# EAGLE schematic mixer (EAGLE 6.5.0)

## Sheet 1 of 2
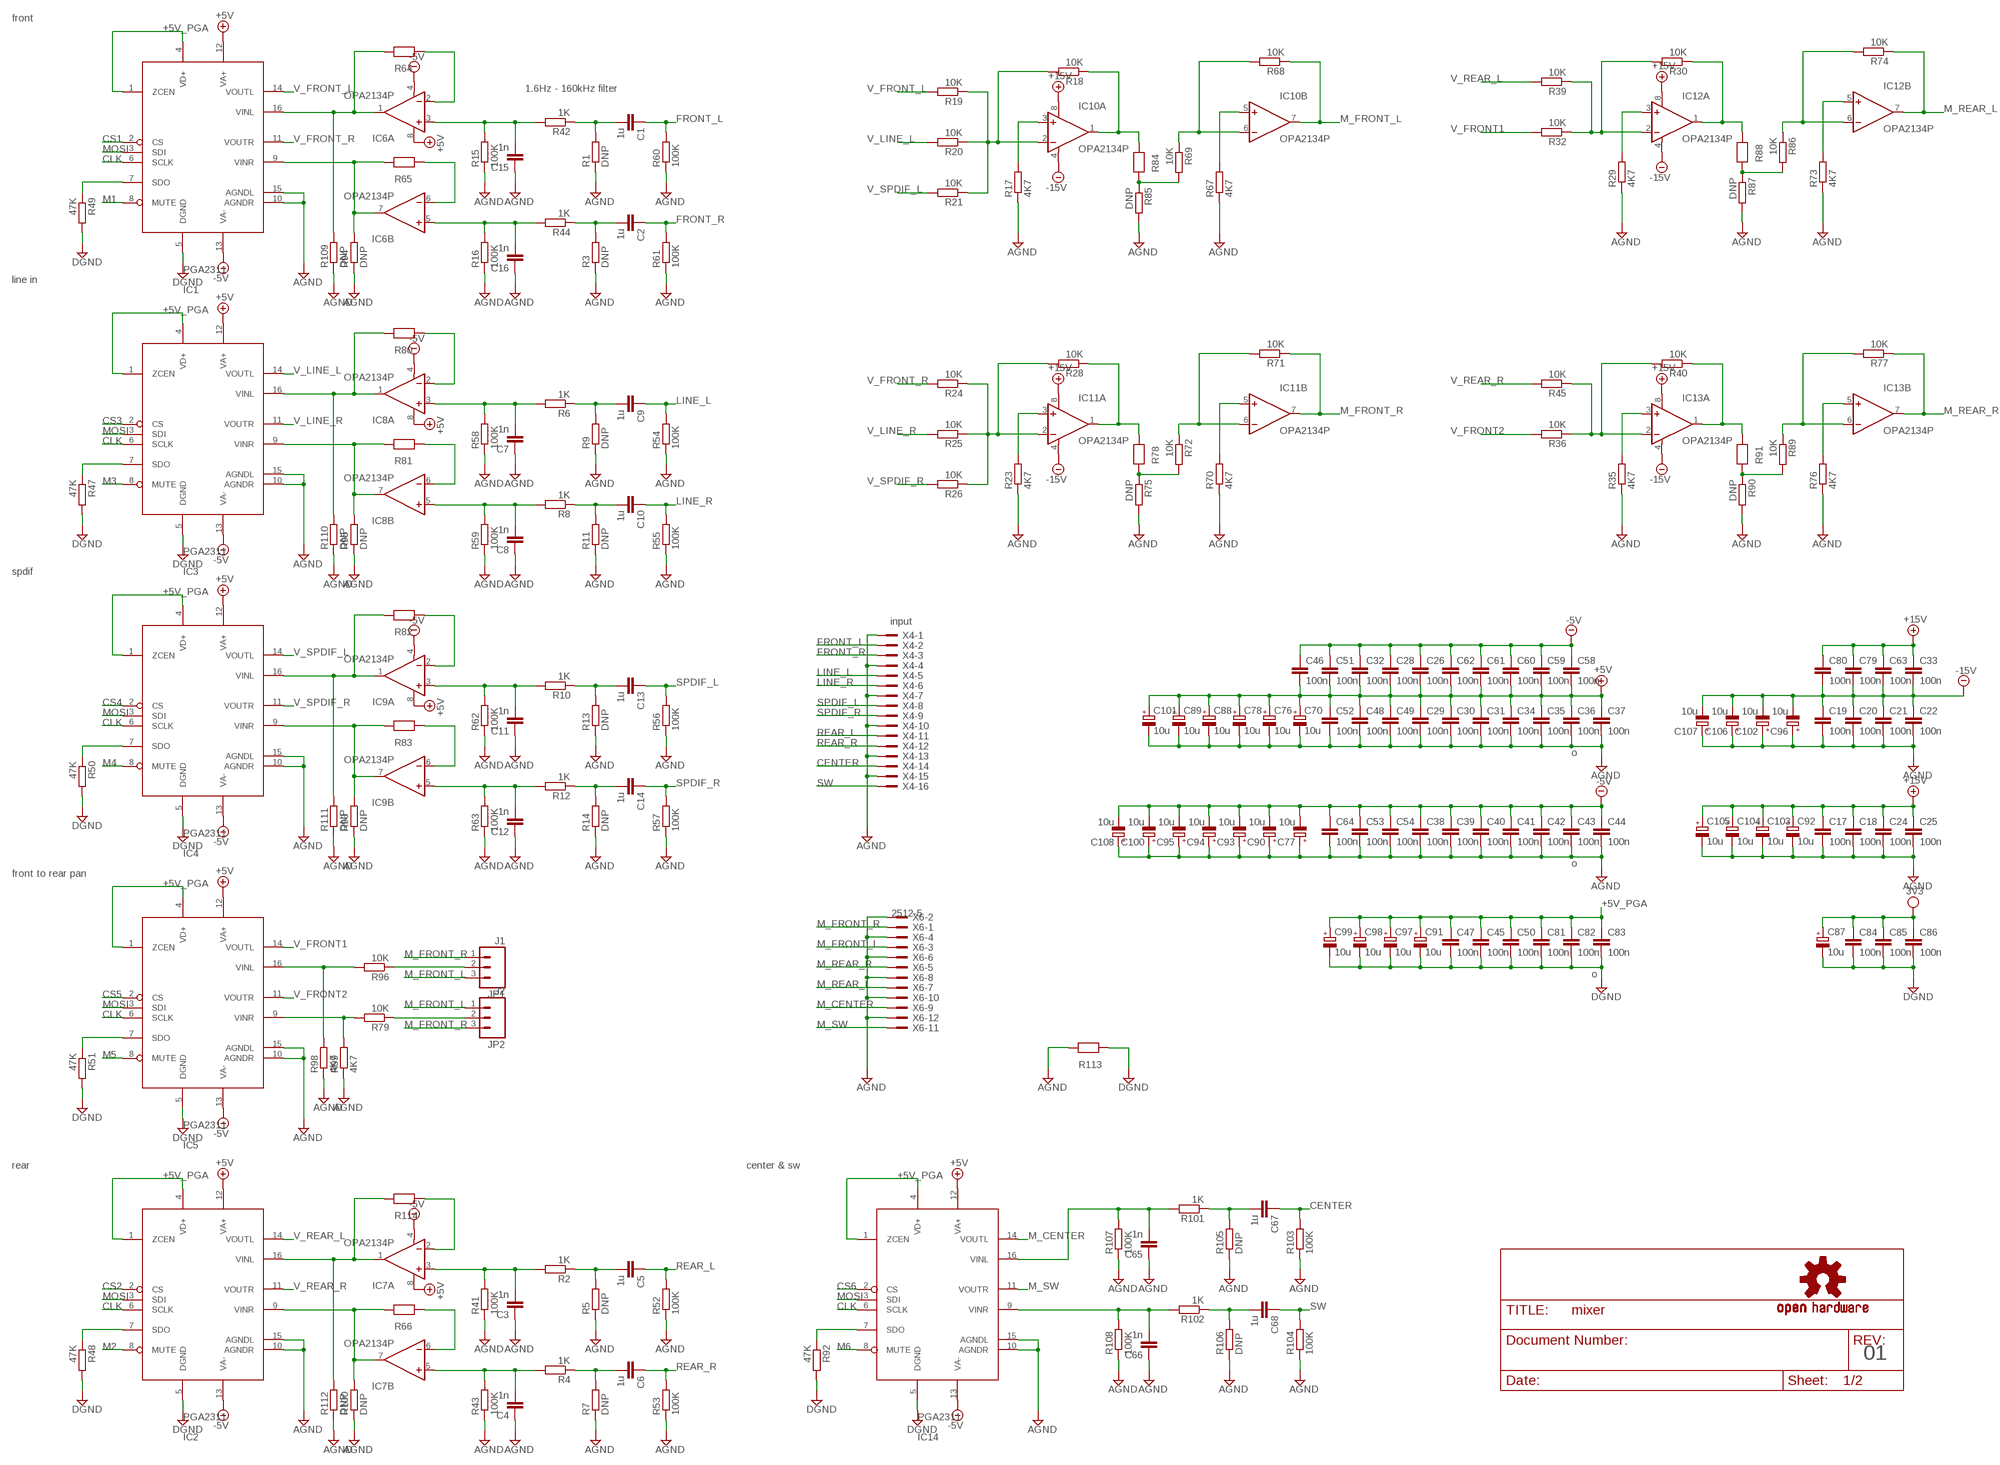
[diagram p0: schematic, sheet 1]

### Parts
C1  1u  C-EUC0805  [C0805]
C2  1u  C-EUC0805  [C0805]
C3  1n  C-EUC0805  [C0805]
C4  1n  C-EUC0805  [C0805]
C5  1u  C-EUC0805  [C0805]
C6  1u  C-EUC0805  [C0805]
C7  1n  C-EUC0805  [C0805]
C8  1n  C-EUC0805  [C0805]
C9  1u  C-EUC0805  [C0805]
C10  1u  C-EUC0805  [C0805]
C11  1n  C-EUC0805  [C0805]
C12  1n  C-EUC0805  [C0805]
C13  1u  C-EUC0805  [C0805]
C14  1u  C-EUC0805  [C0805]
C15  1n  C-EUC0805  [C0805]
C16  1n  C-EUC0805  [C0805]
C17  100n  C-EUC0805  [C0805]
C18  100n  C-EUC0805  [C0805]
C19  100n  C-EUC0805  [C0805]
C20  100n  C-EUC0805  [C0805]
C21  100n  C-EUC0805  [C0805]
C22  100n  C-EUC0805  [C0805]
C24  100n  C-EUC0805  [C0805]
C25  100n  C-EUC0805  [C0805]
C26  100n  C-EUC0805  [C0805]
C28  100n  C-EUC0805  [C0805]
C29  100n  C-EUC0805  [C0805]
C30  100n  C-EUC0805  [C0805]
C31  100n  C-EUC0805  [C0805]
C32  100n  C-EUC0805  [C0805]
C33  100n  C-EUC0805  [C0805]
C34  100n  C-EUC0805  [C0805]
C35  100n  C-EUC0805  [C0805]
C36  100n  C-EUC0805  [C0805]
C37  100n  C-EUC0805  [C0805]
C38  100n  C-EUC0805  [C0805]
C39  100n  C-EUC0805  [C0805]
C40  100n  C-EUC0805  [C0805]
C41  100n  C-EUC0805  [C0805]
C42  100n  C-EUC0805  [C0805]
C43  100n  C-EUC0805  [C0805]
C44  100n  C-EUC0805  [C0805]
C45  100n  C-EUC0805  [C0805]
C46  100n  C-EUC0805  [C0805]
C47  100n  C-EUC0805  [C0805]
C48  100n  C-EUC0805  [C0805]
C49  100n  C-EUC0805  [C0805]
C50  100n  C-EUC0805  [C0805]
C51  100n  C-EUC0805  [C0805]
C52  100n  C-EUC0805  [C0805]
C53  100n  C-EUC0805  [C0805]
C54  100n  C-EUC0805  [C0805]
C58  100n  C-EUC0805  [C0805]
C59  100n  C-EUC0805  [C0805]
C60  100n  C-EUC0805  [C0805]
C61  100n  C-EUC0805  [C0805]
C62  100n  C-EUC0805  [C0805]
C63  100n  C-EUC0805  [C0805]
C64  100n  C-EUC0805  [C0805]
C65  1n  C-EUC0805  [C0805]
C66  1n  C-EUC0805  [C0805]
C67  1u  C-EUC0805  [C0805]
C68  1u  C-EUC0805  [C0805]
C70  10u  CPOL-EU153CLV-0405  [153CLV-0405]
C76  10u  CPOL-EU153CLV-0405  [153CLV-0405]
C77  10u  CPOL-EU153CLV-0405  [153CLV-0405]
C78  10u  CPOL-EU153CLV-0405  [153CLV-0405]
C79  100n  C-EUC0805  [C0805]
C80  100n  C-EUC0805  [C0805]
C81  100n  C-EUC0805  [C0805]
C82  100n  C-EUC0805  [C0805]
C83  100n  C-EUC0805  [C0805]
C84  100n  C-EUC0805  [C0805]
C85  100n  C-EUC0805  [C0805]
C86  100n  C-EUC0805  [C0805]
C87  10u  CPOL-EU153CLV-0405  [153CLV-0405]
C88  10u  CPOL-EU153CLV-0405  [153CLV-0405]
C89  10u  CPOL-EU153CLV-0405  [153CLV-0405]
C90  10u  CPOL-EU153CLV-0405  [153CLV-0405]
C91  10u  CPOL-EU153CLV-0405  [153CLV-0405]
C92  10u  CPOL-EU153CLV-0405  [153CLV-0405]
C93  10u  CPOL-EU153CLV-0405  [153CLV-0405]
C94  10u  CPOL-EU153CLV-0405  [153CLV-0405]
C95  10u  CPOL-EU153CLV-0405  [153CLV-0405]
C96  10u  CPOL-EU153CLV-0405  [153CLV-0405]
C97  10u  CPOL-EU153CLV-0405  [153CLV-0405]
C98  10u  CPOL-EU153CLV-0405  [153CLV-0405]
C99  10u  CPOL-EU153CLV-0405  [153CLV-0405]
C100  10u  CPOL-EU153CLV-0405  [153CLV-0405]
C101  10u  CPOL-EU153CLV-0405  [153CLV-0405]
C102  10u  CPOL-EU153CLV-0405  [153CLV-0405]
C103  10u  CPOL-EU153CLV-0405  [153CLV-0405]
C104  10u  CPOL-EU153CLV-0405  [153CLV-0405]
C105  10u  CPOL-EU153CLV-0405  [153CLV-0405]
C106  10u  CPOL-EU153CLV-0405  [153CLV-0405]
C107  10u  CPOL-EU153CLV-0405  [153CLV-0405]
C108  10u  CPOL-EU153CLV-0405  [153CLV-0405]
IC1  PGA2311  [SO-16]
IC2  PGA2311  [SO-16]
IC3  PGA2311  [SO-16]
IC4  PGA2311  [SO-16]
IC5  PGA2311  [SO-16]
IC6  OPA2134P  [DIL08]
IC7  OPA2134P  [DIL08]
IC8  OPA2134P  [DIL08]
IC9  OPA2134P  [DIL08]
IC10  OPA2134P  [DIL08]
IC11  OPA2134P  [DIL08]
IC12  OPA2134P  [DIL08]
IC13  OPA2134P  [DIL08]
IC14  PGA2311  [SO-16]
JP1  J1  M03PTH  [1X03]
JP2  J2  M03PTH  [1X03]
R1  DNP  R-EU_R0805W  [R0805W]
R2  1K  R-EU_R0805W  [R0805W]
R3  DNP  R-EU_R0805W  [R0805W]
R4  1K  R-EU_R0805W  [R0805W]
R5  DNP  R-EU_R0805W  [R0805W]
R6  1K  R-EU_R0805W  [R0805W]
R7  DNP  R-EU_R0805W  [R0805W]
R8  1K  R-EU_R0805W  [R0805W]
R9  DNP  R-EU_R0805W  [R0805W]
R10  1K  R-EU_R0805W  [R0805W]
R11  DNP  R-EU_R0805W  [R0805W]
R12  1K  R-EU_R0805W  [R0805W]
R13  DNP  R-EU_R0805W  [R0805W]
R14  DNP  R-EU_R0805W  [R0805W]
R15  100K  R-EU_R0805W  [R0805W]
R16  100K  R-EU_R0805W  [R0805W]
R17  4K7  R-EU_R0805W  [R0805W]
R18  10K  R-EU_R0805W  [R0805W]
R19  10K  R-EU_R0805W  [R0805W]
R20  10K  R-EU_R0805W  [R0805W]
R21  10K  R-EU_R0805W  [R0805W]
R23  4K7  R-EU_R0805W  [R0805W]
R24  10K  R-EU_R0805W  [R0805W]
R25  10K  R-EU_R0805W  [R0805W]
R26  10K  R-EU_R0805W  [R0805W]
R28  10K  R-EU_R0805W  [R0805W]
R29  4K7  R-EU_R0805W  [R0805W]
R30  10K  R-EU_R0805W  [R0805W]
R32  10K  R-EU_R0805W  [R0805W]
R35  4K7  R-EU_R0805W  [R0805W]
R36  10K  R-EU_R0805W  [R0805W]
R39  10K  R-EU_R0805W  [R0805W]
R40  10K  R-EU_R0805W  [R0805W]
R41  100K  R-EU_R0805W  [R0805W]
R42  1K  R-EU_R0805W  [R0805W]
R43  100K  R-EU_R0805W  [R0805W]
R44  1K  R-EU_R0805W  [R0805W]
R45  10K  R-EU_R0805W  [R0805W]
R47  47K  R-EU_R0805W  [R0805W]
R48  47K  R-EU_R0805W  [R0805W]
R49  47K  R-EU_R0805W  [R0805W]
R50  47K  R-EU_R0805W  [R0805W]
R51  47K  R-EU_R0805W  [R0805W]
R52  100K  R-EU_R0805W  [R0805W]
R53  100K  R-EU_R0805W  [R0805W]
R54  100K  R-EU_R0805W  [R0805W]
R55  100K  R-EU_R0805W  [R0805W]
R56  100K  R-EU_R0805W  [R0805W]
R57  100K  R-EU_R0805W  [R0805W]
R58  100K  R-EU_R0805W  [R0805W]
R59  100K  R-EU_R0805W  [R0805W]
R60  100K  R-EU_R0805W  [R0805W]
R61  100K  R-EU_R0805W  [R0805W]
R62  100K  R-EU_R0805W  [R0805W]
R63  100K  R-EU_R0805W  [R0805W]
R64  0R_0805  [R0805W]
R65  0R_0805  [R0805W]
R66  0R_0805  [R0805W]
R67  4K7  R-EU_R0805W  [R0805W]
R68  10K  R-EU_R0805W  [R0805W]
R69  10K  R-EU_R0805W  [R0805W]
R70  4K7  R-EU_R0805W  [R0805W]
R71  10K  R-EU_R0805W  [R0805W]
R72  10K  R-EU_R0805W  [R0805W]
R73  4K7  R-EU_R0805W  [R0805W]
R74  10K  R-EU_R0805W  [R0805W]
R75  DNP  R-EU_R0805W  [R0805W]
R76  4K7  R-EU_R0805W  [R0805W]
R77  10K  R-EU_R0805W  [R0805W]
R78  0R_0805  [R0805W]
R79  10K  R-EU_R0805W  [R0805W]
R80  0R_0805  [R0805W]
R81  0R_0805  [R0805W]
R82  0R_0805  [R0805W]
R83  0R_0805  [R0805W]
R84  0R_0805  [R0805W]
R85  DNP  R-EU_R0805W  [R0805W]
R86  10K  R-EU_R0805W  [R0805W]
R87  DNP  R-EU_R0805W  [R0805W]
R88  0R_0805  [R0805W]
R89  10K  R-EU_R0805W  [R0805W]
R90  DNP  R-EU_R0805W  [R0805W]
R91  0R_0805  [R0805W]
R92  47K  R-EU_R0805W  [R0805W]
R93  DNP  R-EU_R0805W  [R0805W]
R94  DNP  R-EU_R0805W  [R0805W]
R95  DNP  R-EU_R0805W  [R0805W]
R96  10K  R-EU_R0805W  [R0805W]
R98  4K7  R-EU_R0805W  [R0805W]
R99  4K7  R-EU_R0805W  [R0805W]
R100  DNP  R-EU_R0805W  [R0805W]
R101  1K  R-EU_R0805W  [R0805W]
R102  1K  R-EU_R0805W  [R0805W]
R103  100K  R-EU_R0805W  [R0805W]
R104  100K  R-EU_R0805W  [R0805W]
R105  DNP  R-EU_R0805W  [R0805W]
R106  DNP  R-EU_R0805W  [R0805W]
R107  100K  R-EU_R0805W  [R0805W]
R108  100K  R-EU_R0805W  [R0805W]
R109  DNP  R-EU_R0805W  [R0805W]
R110  DNP  R-EU_R0805W  [R0805W]
R111  DNP  R-EU_R0805W  [R0805W]
R112  DNP  R-EU_R0805W  [R0805W]
R113  0R_0805  [R0805W]
R114  0R_0805  [R0805W]
U$7  OSHW-LOGOM  [OSHW-LOGO-M]
X4  input  2516-5  [PAK100/2500-5-16]
X6  2512-5  [PAK100/2500-5-12]

### Nets
3V3: C84.1 C85.1 C86.1 C87.+ ; also sheet 2
+5V: C26.2 C28.2 C29.1 C30.1 C31.1 C32.2 C34.1 C35.1 C36.1 C37.1 C46.2 C48.1 C49.1 C51.2 C52.1 C58.2 C59.2 C60.2 C61.2 C62.2 C70.+ C76.+ C78.+ C88.+ C89.+ C101.+ IC1.12(VA+) IC2.12(VA+) IC3.12(VA+) IC4.12(VA+) IC5.12(VA+) IC6.8(A:V+) IC7.8(A:V+) IC8.8(A:V+) IC9.8(A:V+) IC14.12(VA+) ; also sheet 2
+5V_PGA: C45.1 C47.1 C50.1 C81.1 C82.1 C83.1 C91.+ C97.+ C98.+ C99.+ IC1.1(ZCEN) IC1.4(VD+) IC2.1(ZCEN) IC2.4(VD+) IC3.1(ZCEN) IC3.4(VD+) IC4.1(ZCEN) IC4.4(VD+) IC5.1(ZCEN) IC5.4(VD+) IC14.1(ZCEN) IC14.4(VD+) ; also sheet 2
+15V: C17.1 C18.1 C24.1 C25.1 C33.1 C63.1 C79.1 C80.1 C92.+ C103.+ C104.+ C105.+ IC10.8(A:V+) IC11.8(A:V+) IC12.8(A:V+) IC13.8(A:V+) ; also sheet 2
-5V: C26.1 C28.1 C32.1 C38.1 C39.1 C40.1 C41.1 C42.1 C43.1 C44.1 C46.1 C51.1 C53.1 C54.1 C58.1 C59.1 C60.1 C61.1 C62.1 C64.1 C77.- C90.- C93.- C94.- C95.- C100.- C108.- IC1.13(VA-) IC2.13(VA-) IC3.13(VA-) IC4.13(VA-) IC5.13(VA-) IC6.4(A:V-) IC7.4(A:V-) IC8.4(A:V-) IC9.4(A:V-) IC14.13(VA-) ; also sheet 2
-15V: C19.1 C20.1 C21.1 C22.1 C33.2 C63.2 C79.2 C80.2 C96.- C102.- C106.- C107.- IC10.4(A:V-) IC11.4(A:V-) IC12.4(A:V-) IC13.4(A:V-) ; also sheet 2
AGND: C3.1 C4.1 C7.1 C8.1 C11.1 C12.1 C15.1 C16.1 C17.2 C18.2 C19.2 C20.2 C21.2 C22.2 C24.2 C25.2 C29.2 C30.2 C31.2 C34.2 C35.2 C36.2 C37.2 C38.2 C39.2 C40.2 C41.2 C42.2 C43.2 C44.2 C48.2 C49.2 C52.2 C53.2 C54.2 C64.2 C65.1 C66.1 C70.- C76.- C77.+ C78.- C88.- C89.- C90.+ C92.- C93.+ C94.+ C95.+ C96.+ C100.+ C101.- C102.+ C103.- C104.- C105.- C106.+ C107.+ C108.+ IC1.10(AGNDR) IC1.15(AGNDL) IC2.10(AGNDR) IC2.15(AGNDL) IC3.10(AGNDR) IC3.15(AGNDL) IC4.10(AGNDR) IC4.15(AGNDL) IC5.10(AGNDR) IC5.15(AGNDL) IC14.10(AGNDR) IC14.15(AGNDL) R1.1 R3.1 R5.1 R7.1 R9.1 R11.1 R13.1 R14.1 R15.1 R16.1 R17.1 R23.1 R29.1 R35.1 R41.1 R43.1 R52.1 R53.1 R54.1 R55.1 R56.1 R57.1 R58.1 R59.1 R60.1 R61.1 R62.1 R63.1 R67.1 R70.1 R73.1 R75.2 R76.1 R85.2 R87.2 R90.2 R93.1 R94.1 R95.1 R98.1 R99.1 R100.1 R103.1 R104.1 R105.1 R106.1 R107.1 R108.1 R109.1 R110.1 R111.1 R112.1 R113.1 X4.1 X4.4 X4.7 X4.10 X4.13 X4.15 X6.2 X6.4 X6.6 X6.8 X6.10 X6.12 ; also sheet 2
CENTER: C67.1 R103.2 X4.14
CLK: IC1.6(SCLK) IC2.6(SCLK) IC3.6(SCLK) IC4.6(SCLK) IC5.6(SCLK) IC14.6(SCLK) ; also sheet 2
CS1: IC1.2(CS) ; also sheet 2
CS2: IC2.2(CS) ; also sheet 2
CS3: IC3.2(CS) ; also sheet 2
CS4: IC4.2(CS) ; also sheet 2
CS5: IC5.2(CS) ; also sheet 2
CS6: IC14.2(CS) ; also sheet 2
DGND: C45.2 C47.2 C50.2 C81.2 C82.2 C83.2 C84.2 C85.2 C86.2 C87.- C91.- C97.- C98.- C99.- IC1.5(DGND) IC2.5(DGND) IC3.5(DGND) IC4.5(DGND) IC5.5(DGND) IC14.5(DGND) R47.2 R48.2 R49.2 R50.2 R51.2 R92.2 R113.2 ; also sheet 2
FRONT_L: C1.1 R60.2 X4.2
FRONT_R: C2.1 R61.2 X4.3
LINE_L: C9.1 R54.2 X4.5
LINE_R: C10.1 R55.2 X4.6
M1: IC1.8(MUTE) ; also sheet 2
M2: IC2.8(MUTE) ; also sheet 2
M3: IC3.8(MUTE) ; also sheet 2
M4: IC4.8(MUTE) ; also sheet 2
M5: IC5.8(MUTE) ; also sheet 2
M6: IC14.8(MUTE) ; also sheet 2
M_CENTER: IC14.14(VOUTL) X6.9
M_FRONT_L: IC10.7(B:OUT) JP1.3 JP2.1 R68.1 X6.3
M_FRONT_R: IC11.7(B:OUT) JP1.1 JP2.3 R71.1 X6.1
M_REAR_L: IC12.7(B:OUT) R74.1 X6.7
M_REAR_R: IC13.7(B:OUT) R77.1 X6.5
M_SW: IC14.11(VOUTR) X6.11
MOSI: IC1.3(SDI) IC2.3(SDI) IC3.3(SDI) IC4.3(SDI) IC5.3(SDI) IC14.3(SDI) ; also sheet 2
N$1: C1.2 R1.2 R42.1
N$2: C2.2 R3.2 R44.1
N$3: IC14.7(SDO) R92.1
N$4: IC2.16(VINL) IC7.1(A:OUT) R112.2 R114.1
N$5: IC1.16(VINL) IC6.1(A:OUT) R64.1 R109.2
N$7: IC2.9(VINR) IC7.7(B:OUT) R66.1 R100.2
N$8: C4.2 IC7.5(B:+IN) R4.2 R43.2
N$9: C3.2 IC7.3(A:+IN) R2.2 R41.2
N$11: C5.2 R2.1 R5.2
N$12: C6.2 R4.1 R7.2
N$15: IC3.16(VINL) IC8.1(A:OUT) R80.1 R110.2
N$16: IC3.9(VINR) IC8.7(B:OUT) R81.1 R95.2
N$17: IC1.9(VINR) IC6.7(B:OUT) R65.1 R94.2
N$18: C8.2 IC8.5(B:+IN) R8.2 R59.2
N$19: IC4.16(VINL) IC9.1(A:OUT) R82.1 R111.2
N$20: C7.2 IC8.3(A:+IN) R6.2 R58.2
N$22: C9.2 R6.1 R9.2
N$23: C10.2 R8.1 R11.2
N$24: C65.2 IC14.16(VINL) R101.2 R107.2
N$26: IC4.9(VINR) IC9.7(B:OUT) R83.1 R93.2
N$27: C12.2 IC9.5(B:+IN) R12.2 R63.2
N$28: C11.2 IC9.3(A:+IN) R10.2 R62.2
N$29: C16.2 IC6.5(B:+IN) R16.2 R44.2
N$31: C13.2 R10.1 R13.2
N$32: C14.2 R12.1 R14.2
N$33: C15.2 IC6.3(A:+IN) R15.2 R42.2
N$34: C66.2 IC14.9(VINR) R102.2 R108.2
N$36: JP1.2 R96.1
N$37: IC6.2(A:-IN) R64.2
N$42: IC5.16(VINL) R96.2 R98.2
N$43: IC6.6(B:-IN) R65.2
N$44: IC1.7(SDO) R49.1
N$45: IC3.7(SDO) R47.1
N$46: IC10.3(A:+IN) R17.2
N$47: IC10.2(A:-IN) R18.2 R19.1 R20.1 R21.1
N$48: IC7.2(A:-IN) R114.2
N$49: IC10.1(A:OUT) R18.1 R84.2
N$50: IC7.6(B:-IN) R66.2
N$51: IC13.2(A:-IN) R36.1 R40.2 R45.1
N$52: IC11.3(A:+IN) R23.2
N$53: IC11.2(A:-IN) R24.1 R25.1 R26.1 R28.2
N$54: IC10.5(B:+IN) R67.2
N$55: IC10.6(B:-IN) R68.2 R69.1
N$56: IC8.2(A:-IN) R80.2
N$57: IC2.7(SDO) R48.1
N$58: IC12.3(A:+IN) R29.2
N$59: IC4.7(SDO) R50.1
N$61: IC11.5(B:+IN) R70.2
N$62: C67.2 R101.1 R105.2
N$63: C68.2 R102.1 R106.2
N$64: IC13.3(A:+IN) R35.2
N$65: IC5.7(SDO) R51.1
N$66: IC11.6(B:-IN) R71.2 R72.1
N$67: IC8.6(B:-IN) R81.2
N$68: IC12.5(B:+IN) R73.2
N$69: IC12.6(B:-IN) R74.2 R86.1
N$70: IC9.2(A:-IN) R82.2
N$71: IC13.5(B:+IN) R76.2
N$72: IC13.6(B:-IN) R77.2 R89.1
N$73: IC9.6(B:-IN) R83.2
N$74: IC12.2(A:-IN) R30.2 R32.1 R39.1
N$75: IC11.1(A:OUT) R28.1 R78.2
N$76: IC12.1(A:OUT) R30.1 R88.2
N$77: R69.2 R84.1 R85.1
N$78: IC13.1(A:OUT) R40.1 R91.2
N$79: IC5.9(VINR) R79.2 R99.2
N$80: JP2.2 R79.1
N$81: R72.2 R75.1 R78.1
N$84: R86.2 R87.1 R88.1
N$87: R89.2 R90.1 R91.1
REAR_L: C5.1 R52.2 X4.11
REAR_R: C6.1 R53.2 X4.12
SPDIF_L: C13.1 R56.2 X4.8
SPDIF_R: C14.1 R57.2 X4.9
SW: C68.1 R104.2 X4.16
V_FRONT1: IC5.14(VOUTL) R32.2
V_FRONT2: IC5.11(VOUTR) R36.2
V_FRONT_L: IC1.14(VOUTL) R19.2
V_FRONT_R: IC1.11(VOUTR) R24.2
V_LINE_L: IC3.14(VOUTL) R20.2
V_LINE_R: IC3.11(VOUTR) R25.2
V_REAR_L: IC2.14(VOUTL) R39.2
V_REAR_R: IC2.11(VOUTR) R45.2
V_SPDIF_L: IC4.14(VOUTL) R21.2
V_SPDIF_R: IC4.11(VOUTR) R26.2

### Notes on the sheet
- front
- 1.6Hz - 160kHz filter
- line in
- spdif
- o
- o
- front to rear pan
- o
- rear | center & sw
- 01

## Sheet 2 of 2
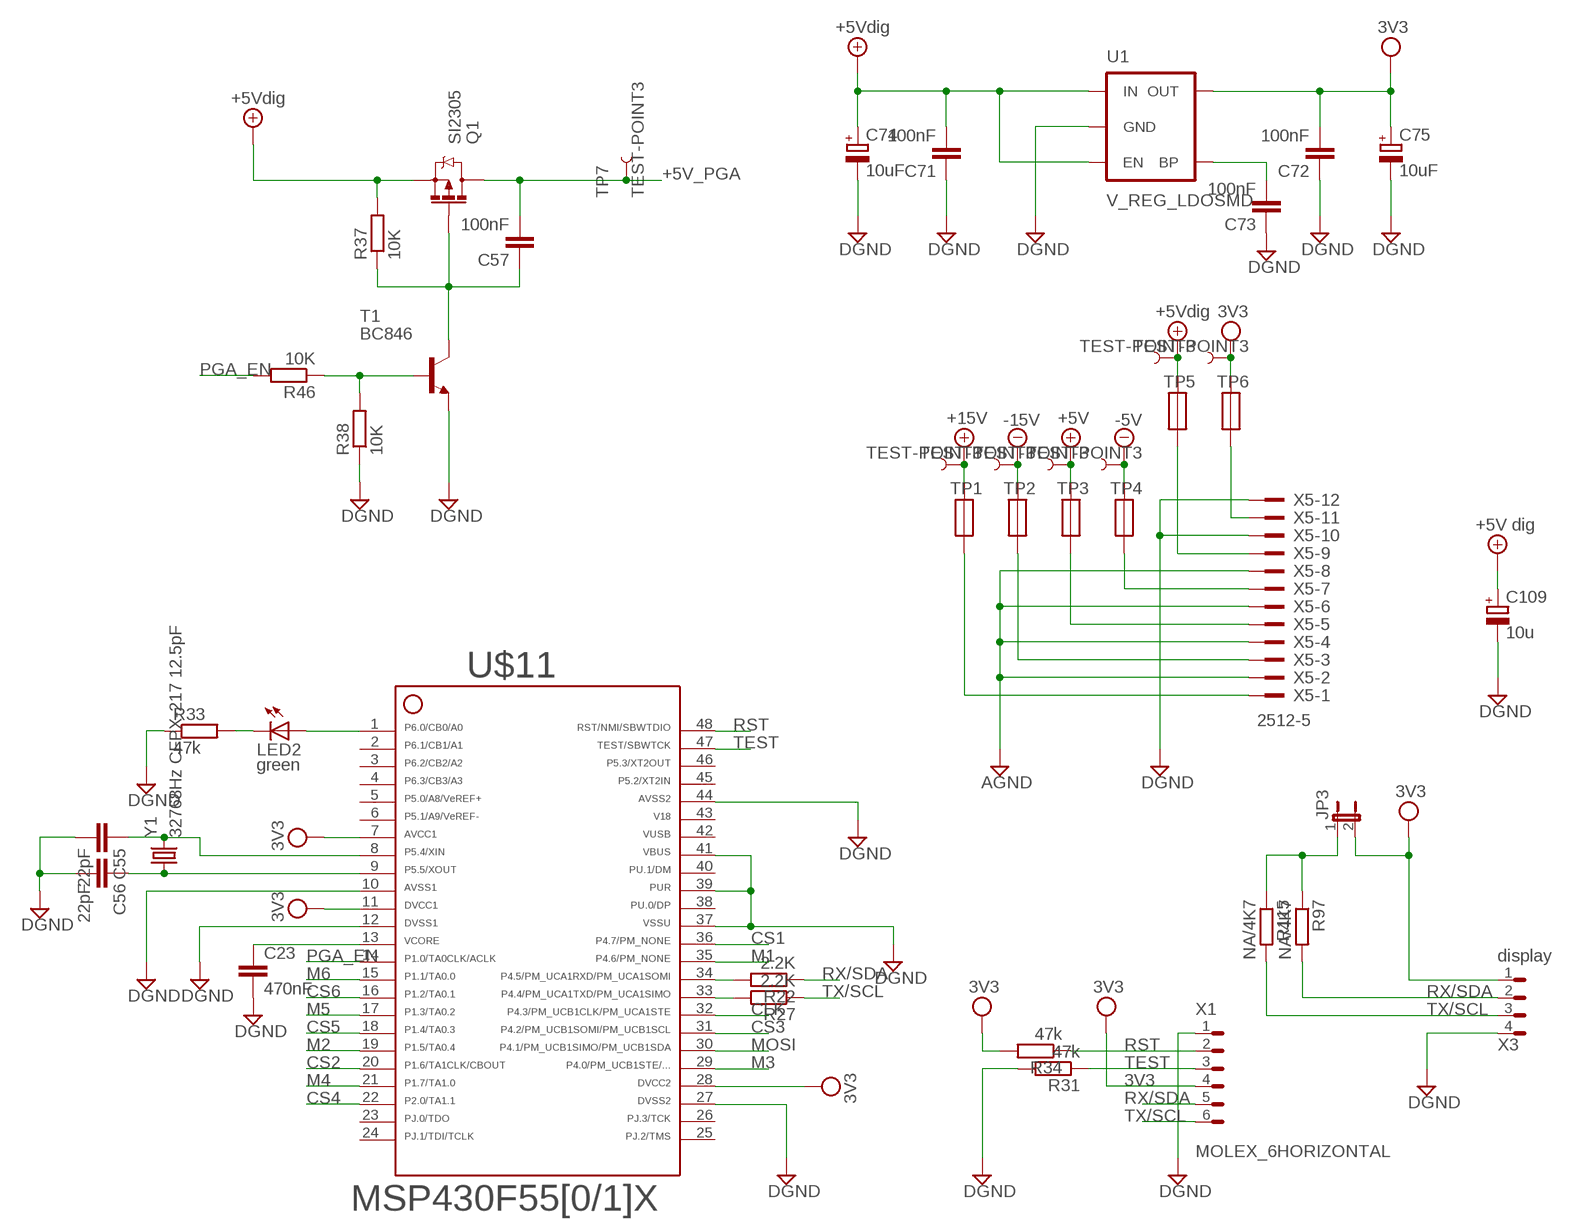
[diagram p1: schematic, sheet 2]

### Parts
C23  470nF  C-EUC0805  [C0805]
C55  22pF  C-EUC0805  [C0805]
C56  22pF  C-EUC0805  [C0805]
C57  100nF  C-EUC0805  [C0805]
C71  100nF  C-EUC0805  [C0805]
C72  100nF  C-EUC0805  [C0805]
C73  100nF  C-EUC0805  [C0805]
C74  10uF  CPOL-EU153CLV-0405  [153CLV-0405]
C75  10uF  CPOL-EU153CLV-0405  [153CLV-0405]
C109  10u  CPOL-EU153CLV-0405  [153CLV-0405]
JP3  JUMPER-2SMD-NO  [SJ_2S-NO]
LED2  green  LEDCHIPLED_0805  [CHIPLED_0805]
Q1  SI2305  MOSFET-PCHANNEL_SOT23-3_POWER  [SOT23-3_POWER]
R22  2.2K  R-EU_R0805W  [R0805W]
R27  2.2K  R-EU_R0805W  [R0805W]
R31  47k  R-EU_R0805W  [R0805W]
R33  47k  R-EU_R0805W  [R0805W]
R34  47k  R-EU_R0805W  [R0805W]
R37  10K  R-EU_R0805W  [R0805W]
R38  10K  R-EU_R0805W  [R0805W]
R46  10K  R-EU_R0805W  [R0805W]
R97  NA/4K7  R-EU_R0805W  [R0805W]
R115  NA/4K7  R-EU_R0805W  [R0805W]
T1  BC846  [SOT23]
TP1  TEST-POINT3  [PAD.03X.03]
TP2  TEST-POINT3  [PAD.03X.03]
TP3  TEST-POINT3  [PAD.03X.03]
TP4  TEST-POINT3  [PAD.03X.03]
TP5  TEST-POINT3  [PAD.03X.03]
TP6  TEST-POINT3  [PAD.03X.03]
TP7  TEST-POINT3  [PAD.03X.03]
U1  V_REG_LDOSMD  [SOT23-5]
U$2  RESETTABLE  [1210]
U$5  RESETTABLE  [1210]
U$6  RESETTABLE  [1210]
U$9  RESETTABLE  [1210]
U$11  F55[0/1]X---PT48  [PT48]
U$12  RESETTABLE  [1210]
U$13  RESETTABLE  [1210]
X1  MOLEX_6HORIZONTAL  [0530480610]
X3  display  MOLEX_4HORIZONTAL  [0530480401]
X5  2512-5  [PAK100/2500-5-12]
Y1  32768Hz CFPX-217 12.5pF  CRYSTAL3.2X1.5  [CRYSTAL-SMD-3.2X1.5]

### Nets
3V3: C72.2 C75.+ JP3.2 R34.2 TP6.P$1 U1.5(OUT) U$11.7 U$11.11 U$11.28 U$13.P$2 X1.4 X3.1 ; also sheet 1
+5V: TP3.P$1 U$6.P$2 ; also sheet 1
+5V/1: C71.2 C74.+ C109.+ Q1.2(S) R37.2 TP5.P$1 U1.1(IN) U1.3(EN) U$12.P$2 ; supply symbol labelled +5Vdig, +5V dig
+5V_PGA: C57.2 Q1.3(D) TP7.P$1 ; also sheet 1
+15V: TP1.P$1 U$2.P$2 ; also sheet 1
-5V: TP4.P$1 U$9.P$2 ; also sheet 1
-15V: TP2.P$1 U$5.P$2 ; also sheet 1
AGND: X5.2 X5.4 X5.6 X5.8 ; also sheet 1
CLK: U$11.32 ; also sheet 1
CS1: U$11.36 ; also sheet 1
CS2: U$11.20 ; also sheet 1
CS3: U$11.31 ; also sheet 1
CS4: U$11.22 ; also sheet 1
CS5: U$11.18 ; also sheet 1
CS6: U$11.16 ; also sheet 1
DGND: C23.2 C55.2 C56.2 C71.1 C72.1 C73.1 C74.- C75.- C109.- R31.2 R33.1 R38.1 T1.2(E) U1.2(GND) U$11.10 U$11.12 U$11.27 U$11.37 U$11.39 U$11.41 U$11.44 X1.1 X3.4 X5.10 X5.12 ; also sheet 1
M1: U$11.35 ; also sheet 1
M2: U$11.19 ; also sheet 1
M3: U$11.29 ; also sheet 1
M4: U$11.21 ; also sheet 1
M5: U$11.17 ; also sheet 1
M6: U$11.15 ; also sheet 1
MOSI: U$11.30 ; also sheet 1
N$6: LED2.A U$11.1
N$10: C23.1 U$11.13
N$13: JP3.1 R97.1 R115.1
N$30: C56.1 U$11.9 Y1.P$1
N$35: C55.1 U$11.8 Y1.P$2
N$38: LED2.C R33.2
N$40: C57.1 Q1.1(G) R37.1 T1.3(C)
N$41: R38.2 R46.1 T1.1(B)
N$60: C73.2 U1.4(BP)
N$85: U$2.P$1 X5.1
N$86: U$5.P$1 X5.3
N$88: U$6.P$1 X5.5
N$89: U$9.P$1 X5.7
N$90: U$12.P$1 X5.9
N$91: U$13.P$1 X5.11
P4.4: R27.2 U$11.33
P4.5: R22.2 U$11.34
PGA_EN: R46.2 U$11.14
RST: R34.1 U$11.48 X1.2
RX/SDA: R22.1 R97.2 X1.5 X3.2
TEST: R31.1 U$11.47 X1.3
TX/SCL: R27.1 R115.2 X1.6 X3.3
Unconnected: U$11.2 U$11.3 U$11.4 U$11.5 U$11.6 U$11.23 U$11.24 U$11.25 U$11.26 U$11.38 U$11.40 U$11.45

## Power pins joined to a net without a drawn wire
42: U$11.42
43: U$11.43
46: U$11.46

## Library data of the parts
C1-C26 C28-C68 C71-C73 C79-C86 = rcl:C-EU: CAPACITOR, European symbol
C70 C76-C78 C87-C109 = rcl:CPOL-EU: POLARIZED CAPACITOR, European symbol
C74 C75 = resistor:CPOL-EU: POLARIZED CAPACITOR, European symbol
IC1-IC5 IC14 = Simplex-ICs:PGA2311: TI PGA2133 stereo audio volume control
IC6-IC13 = burr-brown:OPA2134: Operational Amplifier; MF: TEXAS INSTRUMENTS; MPN: OPA2134PA; OC_FARNELL: 1097574; OC_NEWARK: 74K3897
JP1 JP2 = SparkFun-Connectors:M03: Header 3 Standard 3-pin 0.1" header. Use with straight break away headers (SKU : PRT-00116), right angle break away headers (PRT-00553), swiss pins (PRT-00743), machine pins (PRT-00117), and female headers (PRT-00115). Molex polarized connector foot print use with SKU : PRT-08232 with associated crimp pins and housings.
JP3 = SparkFun-Passives:JUMPER-2: Jumper Basic 0.1" spaced jumper. Use with breakaway headers.
LED2 = led:LED: LED OSRAM: - CHIPLED LG R971, LG N971, LY N971, LG Q971, LY Q971, LO R971, LY R971 LH N974, LH R974 LS Q976, LO Q976, LY Q976 LO Q996 - Hyper CHIPLED LW Q18S LB Q993, LB Q99A, LB R99A - SideLED LS A670, LO A670, LY A670, LG A670, LP A670 LB A673, LV A673, LT A673, LW A673 LH A674 LY A675 LS A676, LA A676, LO A676, LY A676, LW A676 LS A679, LY A679, LG A679 - Hyper Micro SIDELED® LS Y876, LA Y876, LO Y876, LY Y876 LT Y87S - SmartLED LW L88C, LW L88S LB L89C, LB L89S, LG L890 LS L89K, LO L89K, LY L89K LS L896, LA L896, LO L896, LY L896 - TOPLED LS T670, LO T670, LY T670, LG T670, LP T670 LSG T670, LSP T670, LSY T670, LOP T670, LYG T670 LG T671, LOG T671, LSG T671 LB T673, LV T673, LT T673, LW T673 LH T674 LS T676, LA T676, LO T676, LY T676, LB T676, LH T676, LSB T676, LW T676 LB T67C, LV T67C, LT T67C, LS T67K, LO T67K, LY T67K, LW E67C LS E67B, LA E67B, LO E67B, LY E67B, LB E67C, LV E67C, LT E67C LW T67C LS T679, LY T679, LG T679 LS T770, LO T770, LY T770, LG T770, LP T770 LB T773, LV T773, LT T773, LW T773 LH T774 LS E675, LA E675, LY E675, LS T675 LS T776, LA T776, LO T776, LY T776, LB T776 LHGB T686 LT T68C, LB T68C - Hyper Mini TOPLED® LB M676 - Mini TOPLED Santana® LG M470 LS M47K, LO M47K, LY M47K Source: http://www.osram.convergy.de LUXEON: - LUMILED® LXK2-PW12-R00, LXK2-PW12-S00, LXK2-PW14-U00, LXK2-PW14-V00 LXK2-PM12-R00, LXK2-PM12-S00, LXK2-PM14-U00 LXK2-PE12-Q00, LXK2-PE12-R00, LXK2-PE12-S00, LXK2-PE14-T00, LXK2-PE14-U00 LXK2-PB12-K00, LXK2-PB12-L00, LXK2-PB12-M00, LXK2-PB14-N00, LXK2-PB14-P00, LXK2-PB14-Q00 LXK2-PR12-L00, LXK2-PR12-M00, LXK2-PR14-Q00, LXK2-PR14-R00 LXK2-PD12-Q00, LXK2-PD12-R00, LXK2-PD12-S00 LXK2-PH12-R00, LXK2-PH12-S00 LXK2-PL12-P00, LXK2-PL12-Q00, LXK2-PL12-R00 Source: www.luxeon.com KINGBRIGHT: KA-3528ASYC Source: www.kingbright.com
Q1 = Simplex-DiscreteSemi:MOSFET-PCHANNEL: Generic P-channel mosfet
R1-R63 R67-R77 R79 R85-R87 R89 R90 R92-R112 R115 = rcl:R-EU_: RESISTOR, European symbol
R64-R66 R78 R80-R84 R88 R91 R113 R114 = Simplex-Jumpers:0R
T1 = transistor:BC846: NPN TRANSISTOR
TP1-TP7 = SparkFun-Passives:TEST-POINT: Bare copper test points for troubleshooting or ICT
U1 = SparkFun-PowerIC:V_REG_LDO: Voltage Regulator LDO Standard 150mA LDO voltage regulator in SOT-23 layout. Micrel part MIC5205. BP (by-pass) pin is used to lower output noise with 470pF cap.
U$2 U$5 U$6 U$9 U$12 U$13 = Simplex-Fuses:RESETTABLE
U$7 = SparkFun:OSHW-LOGO: Open Source Hardware Logo This logo indicates the piece of hardware it is found on incorporates a OSHW license and/or adheres to the definition of open source hardware found here: http://freedomdefined.org/OSHW
U$11 = TI_MSP430_v16:F55[0/1]X---PT48: ***F55[0/1/2]X*** PT48 Rev. 1.0 06/2010 "http://www.ti.com/lit/gpn/msp430f5509" Only for FF5504, F5508,F5509,F5510
X1 = Simplex-Connectors:MOLEX_6: Molex 6 pin connectors 1.25mm PicoBlade
X3 = Simplex-Connectors:MOLEX_4: Molex 4 pin connectors 1.25mm PicoBlade
X4 = con-3m:2516-: 3M (TM) Pak 100 4-Wall Header Source: 3M; MPN: D2516-5002-AR; OC_FARNELL: 9838376; OC_NEWARK: 12P7055
X5 X6 = Simplex-Connectors:2512-: 3M (TM) Pak 100 4-Wall Header Source: 3M; MPN: N2514-5002RB; OC_FARNELL: 1788673; OC_NEWARK: 97K6709
Y1 = Simplex-FreqCtrl:CRYSTAL: smd crystals

## Net classes
1 vcc: width 0.203 mm